# EAGLE design LED ATtiny85 (EAGLE 9.3.0)
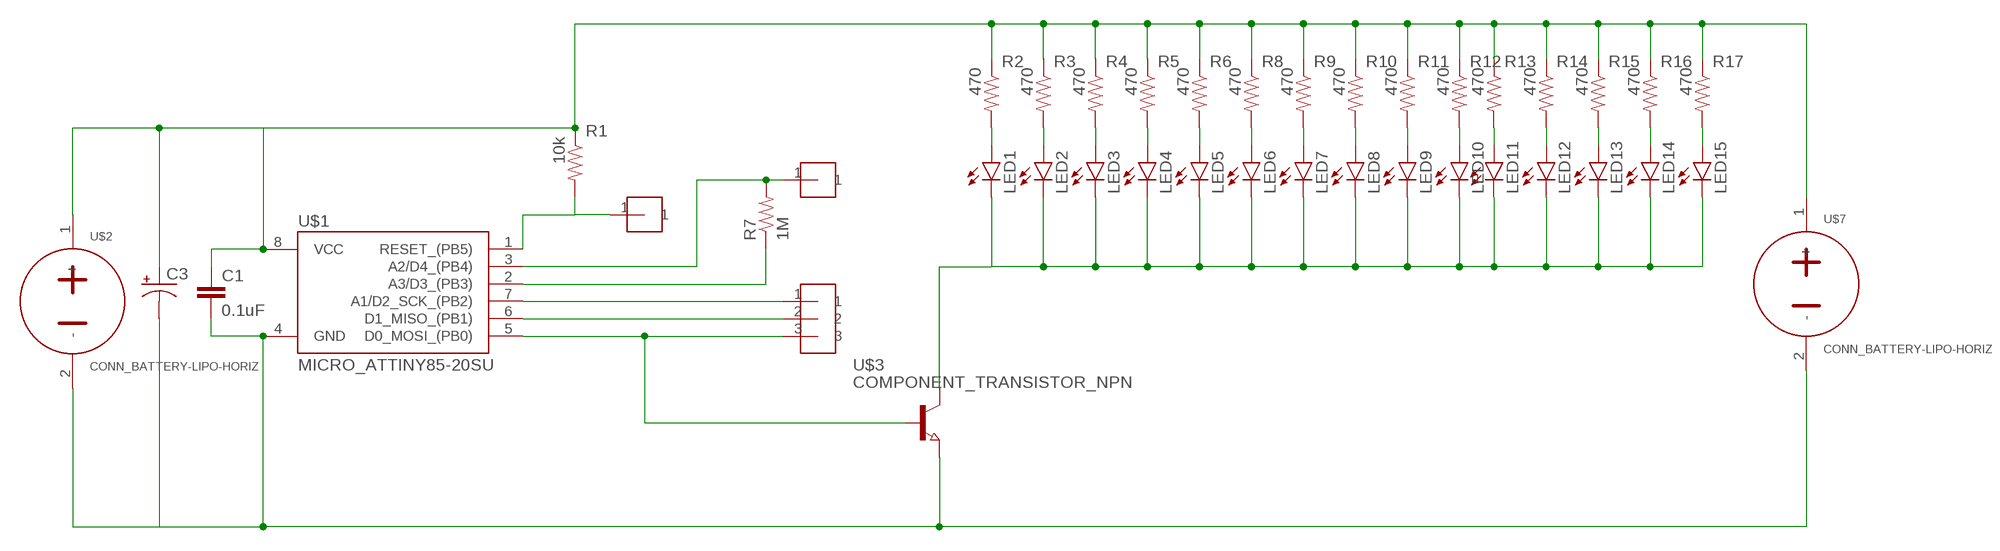
[diagram p0: schematic, sheet 1]

## Parts
C1  0.1uF  COMPONENT_CAP-0805  [0805]
C3  COMPONENT_CAP_POL-6.3MM  [CAP_RADIAL_CAN_10MM]
LED1  LED-0805  [CHIP-LED0805]
LED2  LED-0805  [CHIP-LED0805]
LED3  LED-0805  [CHIP-LED0805]
LED4  LED-0805  [CHIP-LED0805]
LED5  LED-0805  [CHIP-LED0805]
LED6  LED-0805  [CHIP-LED0805]
LED7  LED-0805  [CHIP-LED0805]
LED8  LED-0805  [CHIP-LED0805]
LED9  LED-0805  [CHIP-LED0805]
LED10  LED-0805  [CHIP-LED0805]
LED11  LED-0805  [CHIP-LED0805]
LED12  LED-0805  [CHIP-LED0805]
LED13  LED-0805  [CHIP-LED0805]
LED14  LED-0805  [CHIP-LED0805]
LED15  LED-0805  [CHIP-LED0805]
R1  10k  COMPONENT_RESISTOR-0805  [0805]
R2  470  COMPONENT_RESISTOR-0805  [0805]
R3  470  COMPONENT_RESISTOR-0805  [0805]
R4  470  COMPONENT_RESISTOR-0805  [0805]
R5  470  COMPONENT_RESISTOR-0805  [0805]
R6  470  COMPONENT_RESISTOR-0805  [0805]
R7  1M  COMPONENT_RESISTOR-0805  [0805]
R8  470  COMPONENT_RESISTOR-0805  [0805]
R9  470  COMPONENT_RESISTOR-0805  [0805]
R10  470  COMPONENT_RESISTOR-0805  [0805]
R11  470  COMPONENT_RESISTOR-0805  [0805]
R12  470  COMPONENT_RESISTOR-0805  [0805]
R13  470  COMPONENT_RESISTOR-0805  [0805]
R14  470  COMPONENT_RESISTOR-0805  [0805]
R15  470  COMPONENT_RESISTOR-0805  [0805]
R16  470  COMPONENT_RESISTOR-0805  [0805]
R17  470  COMPONENT_RESISTOR-0805  [0805]
U$1  MICRO_ATTINY85-20SU  [SOIC8]
U$2  CONN_BATTERY-LIPO-HORIZ  [JST-PH-2-SMT-RA]
U$3  COMPONENT_TRANSISTOR_NPN  [SOT23]
U$4  HEADER-1-TESTPOINT  [TESTPOINT-1]
U$5  HEADER-1-TESTPOINT  [TESTPOINT-1]
U$6  HEADER-3-TESTPOINT  [TESTPOINT-3]
U$7  CONN_BATTERY-LIPO-HORIZ  [JST-PH-2-SMT-RA]

## Nets
N$1: C1.1 C3.+ R1.1 R2.1 R3.1 R4.1 R5.1 R6.1 R8.1 R9.1 R10.1 R11.1 R12.1 R13.1 R14.1 R15.1 R16.1 R17.1 U$1.8(VCC) U$2.1(+) U$7.1(+)
N$2: C1.2 C3.- U$1.4(GND) U$2.2(-) U$3.2(E) U$7.2(-)
N$3: R1.2 U$1.1(RESET_(PB5)) U$5.1
N$4: LED1.A R2.2
N$5: U$1.7(A1/D2_SCK_(PB2)) U$6.1
N$6: LED2.A R3.2
N$7: LED3.A R4.2
N$8: LED4.A R5.2
N$9: LED5.A R6.2
N$10: LED1.C LED2.C LED3.C LED4.C LED5.C LED6.C LED7.C LED8.C LED9.C LED10.C LED11.C LED12.C LED13.C LED14.C LED15.C U$3.3(C)
N$11: R7.2 U$1.3(A2/D4_(PB4)) U$4.1
N$12: U$1.6(D1_MISO_(PB1)) U$6.2
N$13: U$1.5(D0_MOSI_(PB0)) U$3.1(B) U$6.3
N$14: R7.1 U$1.2(A3/D3_(PB3))
N$15: LED14.A R16.2
N$16: LED13.A R15.2
N$17: LED12.A R14.2
N$18: LED11.A R13.2
N$19: LED10.A R12.2
N$20: LED9.A R11.2
N$21: LED8.A R10.2
N$22: LED7.A R9.2
N$23: LED6.A R8.2
N$24: LED15.A R17.2

## Library data of the parts
C1 = homemade-hardware:COMPONENT_CAP: Capacitor Standard 0603 ceramic capacitor, and 0.1" leaded capacitor.
C3 = homemade-hardware:COMPONENT_CAP_POL: Capacitor Polarized These are standard SMD and PTH capacitors. Normally 47uF, 100uF, and 470uF in electrolytic and tantalum varieties. Always verify the external diameter of the through hole cap, it varies with capacity, voltage, and manufacturer. The EIA devices should be standard.
LED1-LED15 = homemade-hardware:LED: LEDs Standard schematic elements and footprints for 5mm, 3mm, 1206, and 0603 sized LEDs. 5mm - Spark Fun Electronics SKU : COM-00529 (and others)
R1-R17 = homemade-hardware:COMPONENT_RESISTOR
U$1 = homemade-hardware:MICRO_ATTINY85
U$2 U$7 = homemade-hardware:CONN_BATTERY
U$3 = homemade-hardware:COMPONENT_TRANSISTOR_NPN: BSS806NH6327XTSA1 <https://www.digikey.com/product-detail/en/infineon-technologies/BSS806NH6327XTSA1/BSS806NH6327XTSA1DKR-ND/3196843>: NPN Moseft Transistor - 20V 2.3A; PN: BSS806NH6327XTSA1
U$4 U$5 = homemade-hardware:HEADER-1: M20-8890845 <https://www.digikey.com/products/en?keywords=952-3236-ND>: Horizontal Male SMD Headers M20-7910842R <https://www.digikey.com/product-detail/en/harwin-inc/M20-7910842R/952-3200-6-ND/6559341>: Horizontal Female SMD Headers
U$6 = homemade-hardware:HEADER-3: NPTC081KFXC-RC <https://www.digikey.com/product-detail/en/sullins-connector-solutions/NPTC081KFXC-RC/S5600-ND/776058>: Vertical Female SMD Headers TSM-110-01-T-SV <https://www.digikey.com/product-detail/en/samtec-inc/TSM-110-01-T-SV/SAM12267-ND/6691889>: Vertical Male SMD Headers M20-8890845 <https://www.digikey.com/products/en?keywords=952-3236-ND>: Horizontal Male SMD Headers M20-7910842R <https://www.digikey.com/product-detail/en/harwin-inc/M20-7910842R/952-3200-6-ND/6559341>: Horizontal Female SMD Headers

## Board
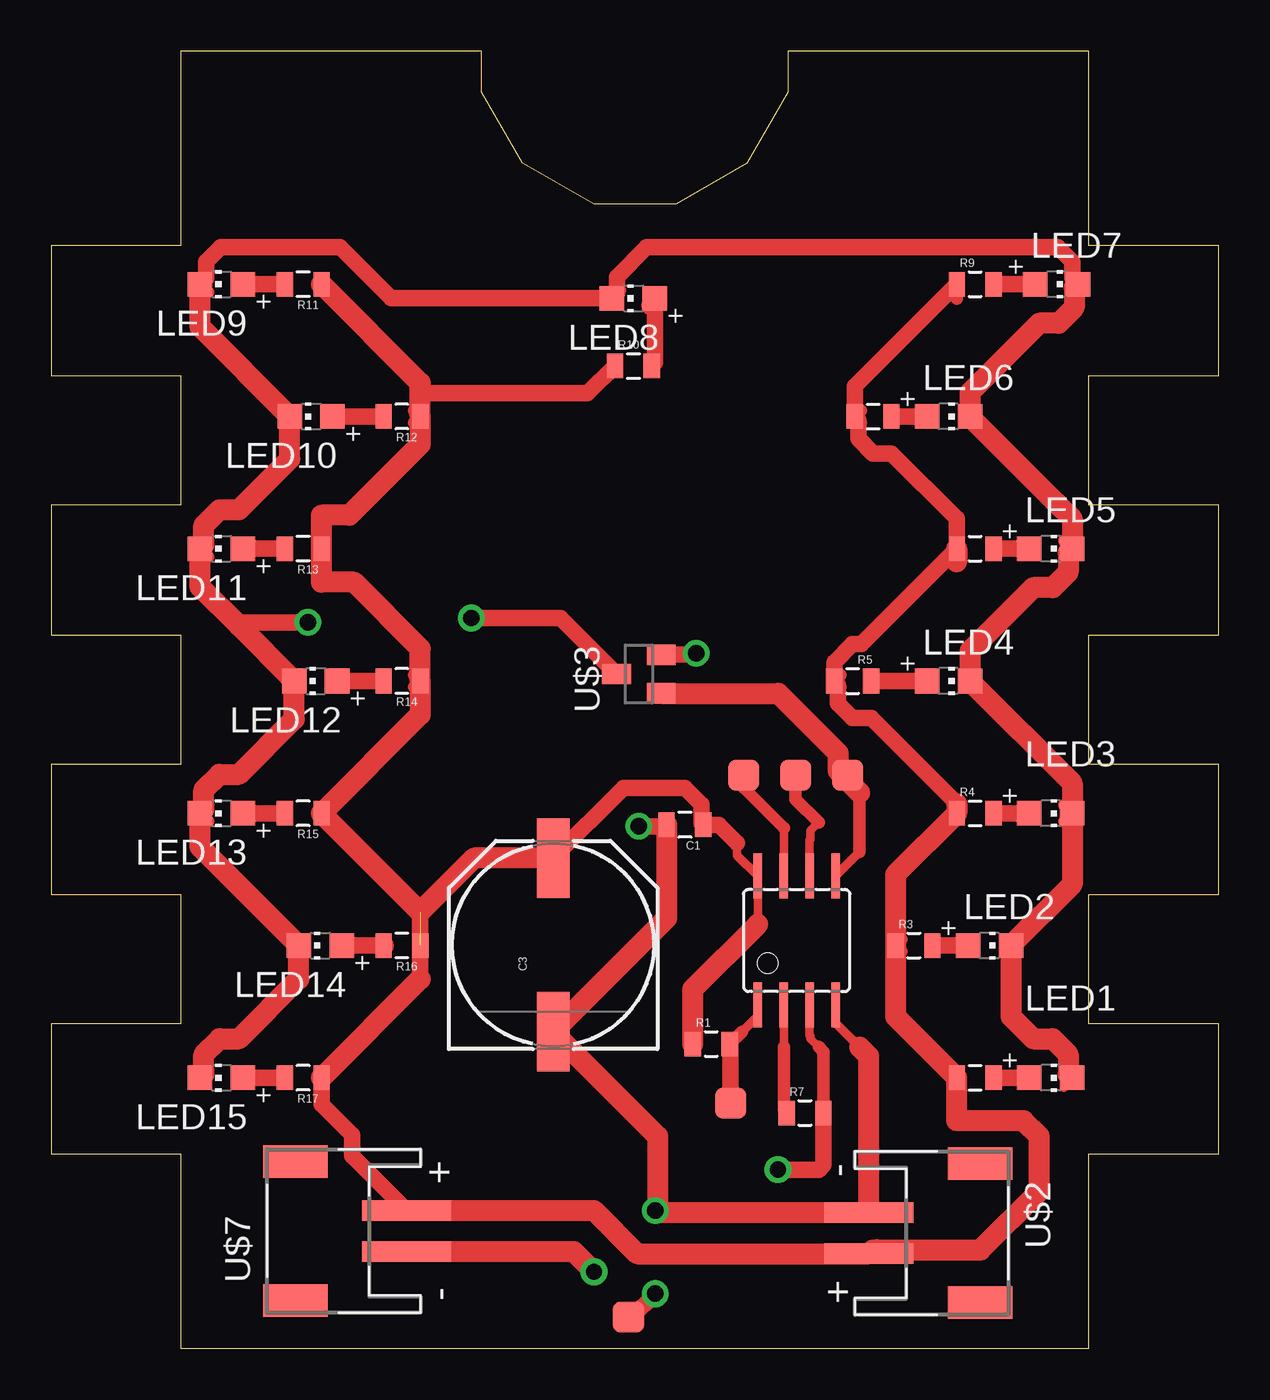
[diagram p1: board, top side]
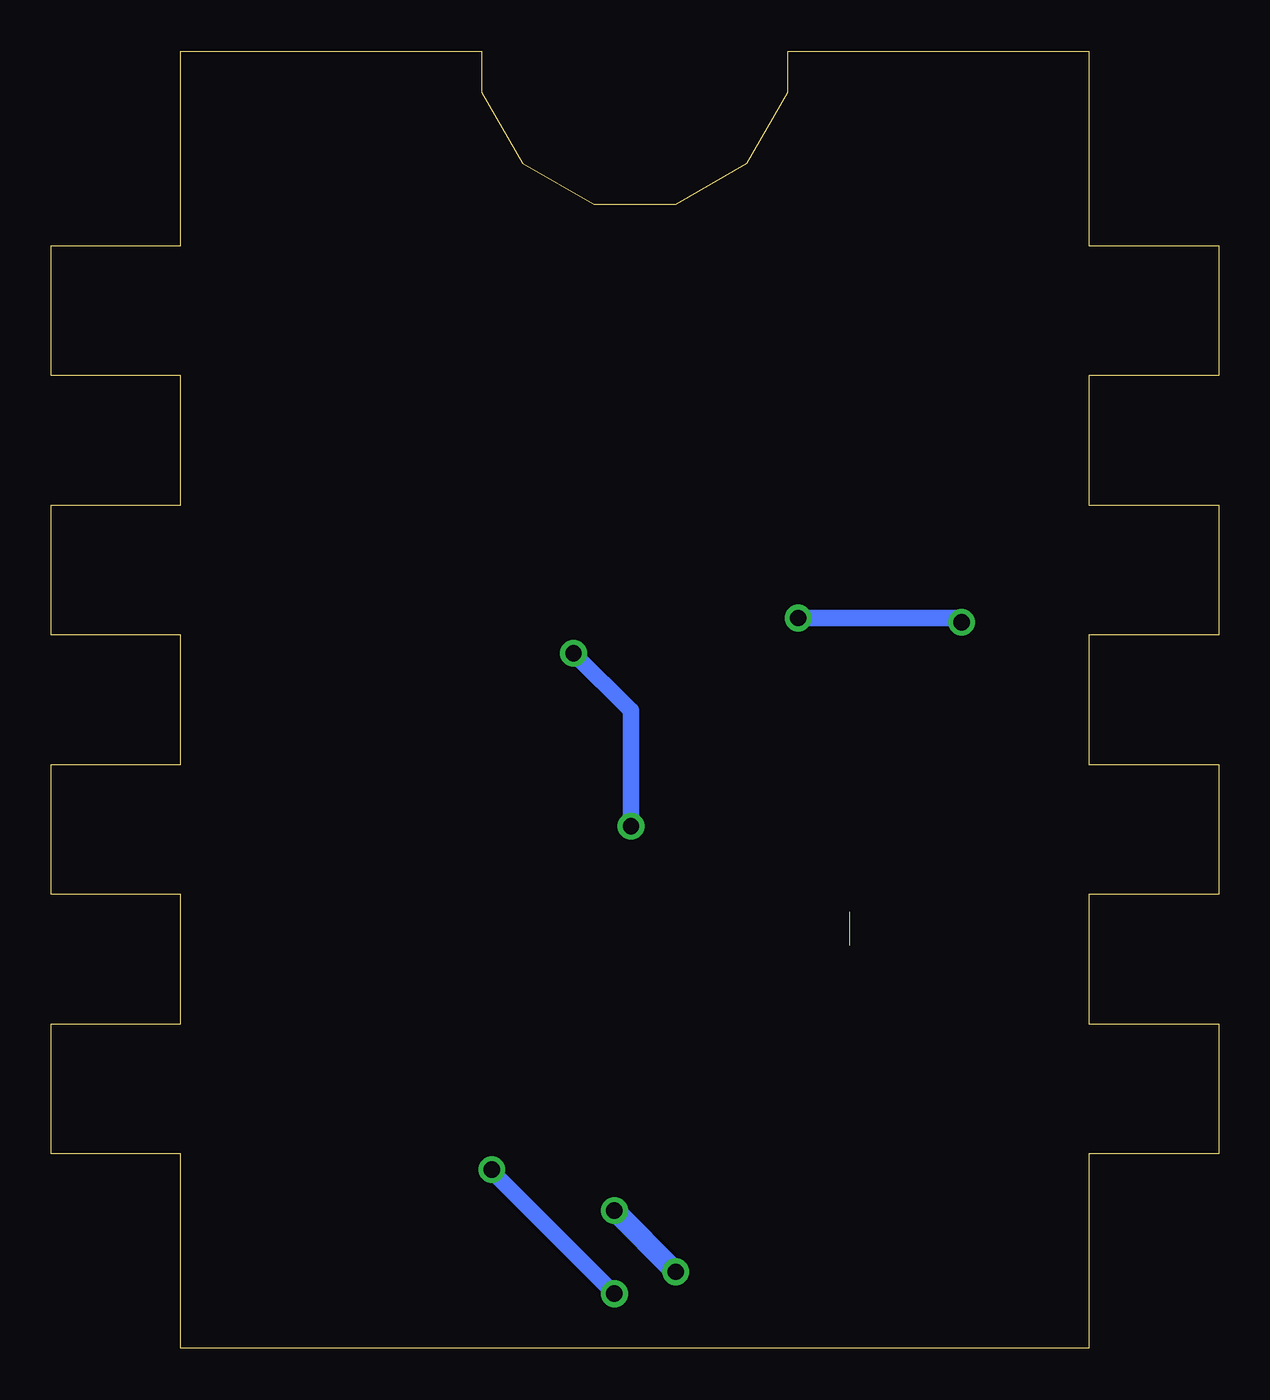
[diagram p2: board, bottom side, seen from below]

Size 57.15 x 63.5 mm. Coordinates in mm from the lower left corner, seen from the top.
Outline: 57.15,47.62 57.15,53.98 50.8,53.98 50.8,63.5 36.08,63.5 36.08,61.49 34.07,58.01 30.58,56 26.57,56 23.09,58.01 21.07,61.49 21.07,63.5 6.35,63.5 6.35,53.98 0,53.98 0,47.62 6.35,47.62 6.35,41.27 0,41.27 0,34.92 6.35,34.92 6.35,28.57 0,28.57 0,22.23 6.35,22.23 6.35,15.88 0,15.88 0,9.53 6.35,9.53 6.35,0 50.8,0 50.8,9.53 57.15,9.53 57.15,15.88 50.8,15.88 50.8,22.23 57.15,22.23 57.15,28.57 50.8,28.57 50.8,34.92 57.15,34.92 57.15,41.27 50.8,41.27 50.8,47.62 57.15,47.62
Copper layers (1*16): Top 0.035mm / dielectric 1.5mm / Bottom 0.035mm
Design rules "default": minimum track width 16mil, minimum drill 0.8mm, track to track 0.8mm, track to pad 0.8mm, pad to pad 0.8mm, via to via 0.8mm, smd to smd 0mil, copper to edge 1mil, drill to drill 1mil, minimum pad ring 10mil, minimum via ring 10mil, stop-mask expansion 1mil, vias tented up to drill 30mil, thermal gap 10mil

### Footprints (pad centres in the part's own frame; a part is rotated, then mirrored left to right if it is on the bottom)
0805 = smd 0.8 x 1.2: 1 -0.9,0; 2 0.9,0
CAP_RADIAL_CAN_10MM = smd 3.9 x 1.6: + 4.25,0; - -4.25,0
CHIP-LED0805 = smd 1.2 x 1.2: A 0,-1.05; C 0,1.05
SOIC8 = smd 0.4 x 2.2: 1 -1.905,-3.154; 2 -0.635,-3.154; 3 0.635,-3.154; 4 1.905,-3.154; 5 1.905,3.154; 6 0.635,3.154; 7 -0.635,3.154; 8 -1.905,3.154
JST-PH-2-SMT-RA = smd 1 x 4.35: 1 1,-3.825; 2 -1,-3.825 | smd 1.6 x 3.15: NC1 -3.4,1.625; NC2 3.4,1.625
SOT23 = smd 1 x 1.4: 1 -0.95,-1.1; 2 0.95,-1.1; 3 0,1.1
TESTPOINT-1 = smd 1.524 x 1.524: 1 0,0
TESTPOINT-3 = smd 1.524 x 1.524: 1 0,0; 2 2.54,0; 3 5.08,0

### Placement (x,y rotation side)
C1  31.03,25.63 180 top
C3  24.57,19.75 90 top
LED1  48.93,13.24 270 top
LED2  45.93,19.72 270 top
LED3  48.93,26.19 270 top
LED4  43.93,32.67 270 top
LED5  48.93,39.14 270 top
LED6  43.93,45.62 270 top
LED7  49.23,52.09 270 top
LED8  28.51,51.4 90 top
LED9  8.34,52.09 90 top
LED10  12.73,45.62 90 top
LED11  8.34,39.14 90 top
LED12  12.95,32.67 90 top
LED13  8.34,26.19 90 top
LED14  13.17,19.72 90 top
LED15  8.34,13.24 90 top
R1  32.32,14.9 0 top
R2  45.23,13.24 0 top
R3  42.23,19.72 0 top
R4  45.23,26.19 0 top
R5  39.23,32.67 0 top
R6  45.23,39.14 0 top
R7  36.91,11.52 0 top
R8  40.23,45.62 0 top
R9  45.23,52.09 0 top
R10  28.51,48.09 0 top
R11  12.34,52.09 180 top
R12  17.17,45.62 180 top
R13  12.34,39.14 180 top
R14  17.17,32.67 180 top
R15  12.34,26.19 180 top
R16  17.17,19.72 180 top
R17  12.34,13.24 180 top
U$1  36.5,19.97 0 top
U$2  43.86,5.64 270 top
U$3  28.78,33.01 90 top
U$4  28.26,1.54 90 top
U$5  33.27,12 90 top
U$6  33.91,28.06 0 top
U$7  13.57,5.75 90 top

### Tracks (layer width: path | path; a pad name or v marks a point on that pad's centre or on a via)
N$1  (1 unrouted)
  Top 0.406: 33.58,24.75 33.58,24.14 U$1.8 34.59,20.77 34.58,20.75
  Top 0.61: C1.1 32.04,25.75 | U$2.1 40.43,5.04 | 41.63,19.42 R3.1 41.63,20.01 | 38.63,32.37 R5.1 38.63,32.96 | R6.1 44.34,39.85 | 39.63,45.32 R8.1 39.63,45.91 | 44.34,51.38 R9.1 | 17.78,45.91 R12.1 17.78,45.32 | 17.78,32.96 R14.1 17.78,32.37
  Top 0.813: R9.1 39.34,47.09 R8.1 39.52,45.43 39.52,44.52 40.23,43.81 41.14,43.81 44.34,40.62 R6.1 39.67,34.47 39.23,34.47 38.34,33.57 R5.1 38.52,32.48 38.52,31.57 39.23,30.86 40.14,30.86 44.34,26.67 | 18.07,21.36 18.07,18.08 | R10.1 26.26,46.75 18.07,46.75 | U$7.1 14.73,9.42 14.73,10.45 13.24,11.94 R17.1 | 33.58,24.75 32.69,25.63 C1.1 31.84,25.72 31.84,26.63 31.03,27.44 28.01,27.44 C3.+
  Top 1.016: U$7.1 26.57,6.75 28.68,4.64 U$2.1 40.21,4.82 45.49,4.82 48.36,7.7 48.36,10.38 47.6,11.15 44.34,11.15 R2.1 41.34,16.25 R3.1 41.34,23.19 R4.1 44.34,26.67 | R11.1 18.07,47.26 18.07,46.75 R12.1 18.07,44.25 14.61,40.78 13.24,40.78 R13.1 13.24,37.5 14.82,37.5 18.07,34.25 R14.1 18.07,31.03 R15.1 18.07,21.36 20.71,24 C3.+ | 18.07,18.08 R17.1 | R6.1 44.34,38.51 | R1.1 31.42,17.59 34.59,20.77
N$2  (via drill 0.8)
  Top 0.406: U$1.4 38.4,15.93 39.58,14.75
  Top 0.61: U$3.2 29.96,33.88 | C1.2 30.22,25.54 | 40.58,6.45 U$2.2
  Top 0.813: C3.- 24.57,14.75 | U$3.2 31.51,33.96 v31.57,34.02 | v28.77,25.56 30.05,25.56 C1.2
  Top 1.016: U$7.2 25.57,4.75 v26.57,3.75 | 29.68,6.64 U$2.2 40.03,14.3 39.58,14.75 | 29.68,6.64 v29.57,6.75 | 29.68,6.64 29.68,10.39 C3.- 30.12,21.05 C1.2
  Bottom 0.813: v31.57,34.02 28.77,31.21 v28.77,25.56
  Bottom 1.016: v26.57,3.75 v29.57,6.75
N$3
  Top 0.406: U$1.1 34.59,16.27 33.82,15.5
  Top 0.61: R1.2 33.82,15.5
  Top 0.813: R1.2 33.27,14.85 U$5.1
N$4
  Top 0.813: R2.2 LED1.A
N$5
  Top 0.406: U$1.7 35.86,25.46
  Top 0.61: 35.86,25.46 33.91,27.42 U$6.1
N$6
  Top 0.813: R3.2 LED2.A
N$7
  Top 0.813: R4.2 LED3.A
N$8
  Top 0.813: R5.2 LED4.A
N$9
  Top 0.813: R6.2 LED5.A
N$10  (via drill 0.8)
  Top 0.406: LED1.C 49.98,13.16 49.58,12.75
  Top 0.61: LED15.C 7.68,13.64 | 7.68,25.8 LED13.C 7.68,26.59 | 7.68,38.75 LED11.C 7.68,39.54 | 7.68,51.7 LED9.C 7.68,52.48 | 49.88,51.7 LED7.C 49.88,52.48 | 44.98,46.13 LED6.C | 49.59,39.54 LED5.C 49.59,38.75 | 49.59,26.59 LED3.C 49.59,25.8 | 49.59,13.64 LED1.C | LED8.C 27.85,51.79
  Top 0.813: LED9.C 7.58,52.38 7.58,53.19 8.29,53.9 14.14,53.9 16.64,51.4 LED8.C 27.69,51.63 27.69,52.44 29.15,53.9 49.28,53.9 49.98,53.19 49.98,52.38 LED7.C | U$3.3 24.94,35.75 v20.57,35.75 | v12.57,35.54 9.36,35.54 9.2,35.37
  Top 1.016: LED15.C 7.48,13.44 7.48,14.39 8.25,15.15 9.2,15.15 12.12,18.08 LED14.C 7.29,24.55 LED13.C 7.48,26.39 7.48,27.34 8.25,28.1 9.2,28.1 11.9,30.8 LED12.C 9.2,35.37 7.29,37.28 LED11.C 7.48,39.33 7.48,40.28 8.25,41.05 9.2,41.05 11.68,43.53 LED10.C 7.29,50 LED9.C | LED7.C 50.08,51.9 50.08,50.95 49.32,50.18 48.37,50.18 44.98,46.8 LED6.C 49.21,41.38 49.98,40.62 LED5.C 49.79,38.95 49.79,38 49.02,37.23 48.07,37.23 44.98,34.14 LED4.C 49.98,27.67 LED3.C 49.98,22.72 LED2.C 46.98,16.25 48.07,15.15 49.02,15.15 49.79,14.39 49.79,13.44 LED1.C
  Bottom 0.813: v20.57,35.75 12.79,35.75 v12.57,35.54
N$11  (via drill 0.8)
  Top 0.406: U$1.3 37.13,15.75 37.13,15.33 37.17,15.29 37.17,15.16 37.58,14.75
  Top 0.61: 37.58,14.75 37.8,14.52 37.8,10.75
  Top 0.813: U$4.1 28.44,1.54 v29.57,2.68 | v35.58,8.75 37.58,8.75 37.8,8.98 37.8,10.75 R7.2
  Bottom 0.813: v29.57,2.68 35.58,8.68 v35.58,8.75
N$12
  Top 0.406: U$1.6 37.13,24.89 37.17,24.92 37.17,25.34 37.58,25.75
  Top 0.61: 37.58,25.75 36.45,26.88 U$6.2
N$13
  Top 0.406: U$1.5 39.58,24.3
  Top 0.61: U$6.3 38.96,27.82 38.31,28.47 | 39.58,24.3 39.58,27.2
  Top 1.016: U$3.1 35.59,32.06 38.52,29.14 38.52,28.27 38.96,27.82 39.58,27.2
N$14
  Top 0.406: U$1.2 35.86,14.75 | 35.86,14.75
  Top 0.508: R7.1 35.86,11.66
  Top 0.61: 35.86,11.66 35.86,14.75
N$15
  Top 0.813: LED14.A R16.2
  Top 1.016: R16.2
N$16
  Top 0.813: R15.2 LED13.A
  Top 1.016: LED13.A
N$17
  Top 0.813: R14.2 LED12.A
  Top 1.016: LED12.A
N$18
  Top 0.813: R13.2 LED11.A
  Top 1.016: LED11.A
N$19
  Top 0.813: R12.2 LED10.A
  Top 1.016: LED10.A
N$20
  Top 0.813: R11.2 LED9.A
  Top 1.016: LED9.A
N$21
  Top 0.406: 29.55,48.24 R10.2
  Top 0.813: LED8.A 29.55,48.24
  Top 1.016: 29.4,51.06 29.46,51.12 29.46,51.3 LED8.A
N$22
  Top 0.813: R9.2 LED7.A
N$23
  Top 0.813: R8.2 LED6.A
N$24
  Top 0.813: R17.2 LED15.A